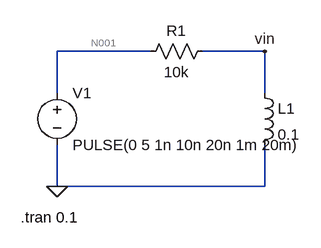
[diagram p0: schematic RL_circuit.asc]
RL_circuit.asc, the LTspice schematic file:
Version 4
SHEET 1 880 680
WIRE 224 64 80 64
WIRE 400 64 304 64
WIRE 80 128 80 64
WIRE 400 128 400 64
WIRE 80 272 80 208
WIRE 400 272 400 208
WIRE 400 272 80 272
FLAG 80 272 0
FLAG 400 64 vin
SYMBOL voltage 80 112 R0
WINDOW 123 0 0 Left 0
WINDOW 39 0 0 Left 0
SYMATTR InstName V1
SYMATTR Value PULSE(0 5 1n 10n 20n 1m 20m)
SYMBOL ind 384 112 R0
SYMATTR InstName L1
SYMATTR Value 0.1
SYMBOL res 320 48 R90
WINDOW 0 0 56 VBottom 2
WINDOW 3 32 56 VTop 2
SYMATTR InstName R1
SYMATTR Value 10k
TEXT 24 320 Left 2 !.tran 0.1

The netlist it stands for:
* RL_circuit.asc
V1 N001 0 PULSE(0 5 1n 10n 20n 1m 20m)
L1 vin 0 0.1
R1 vin N001 10k
.tran 0.1
.backanno
.end

* Results of the author's LTspice run, read from the files saved beside the schematic
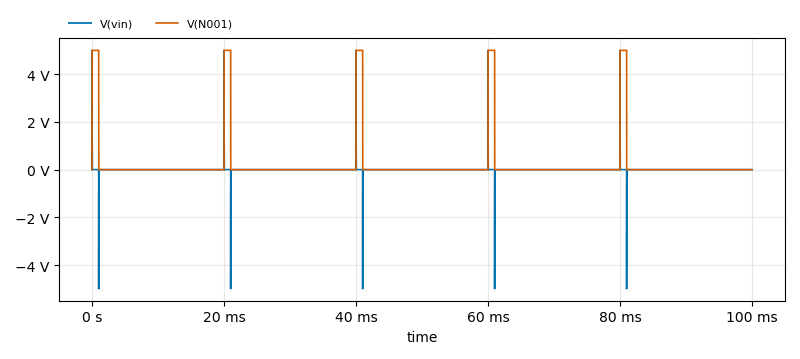
[diagram p1: Transient Analysis of RL_circuit.asc, plotted from the saved traces]
* Transient Analysis, 1 run:
*   V(vin): min -4.995 V, max 4.998 V, average 87.15 µV, rms 116.1 mV, last 0 V
*   V(N001): min 0 V, max 5 V, average 250 mV, rms 1.118 V, last 0 V